# EAGLE design REP - Rev3 (EAGLE 9.6.2)
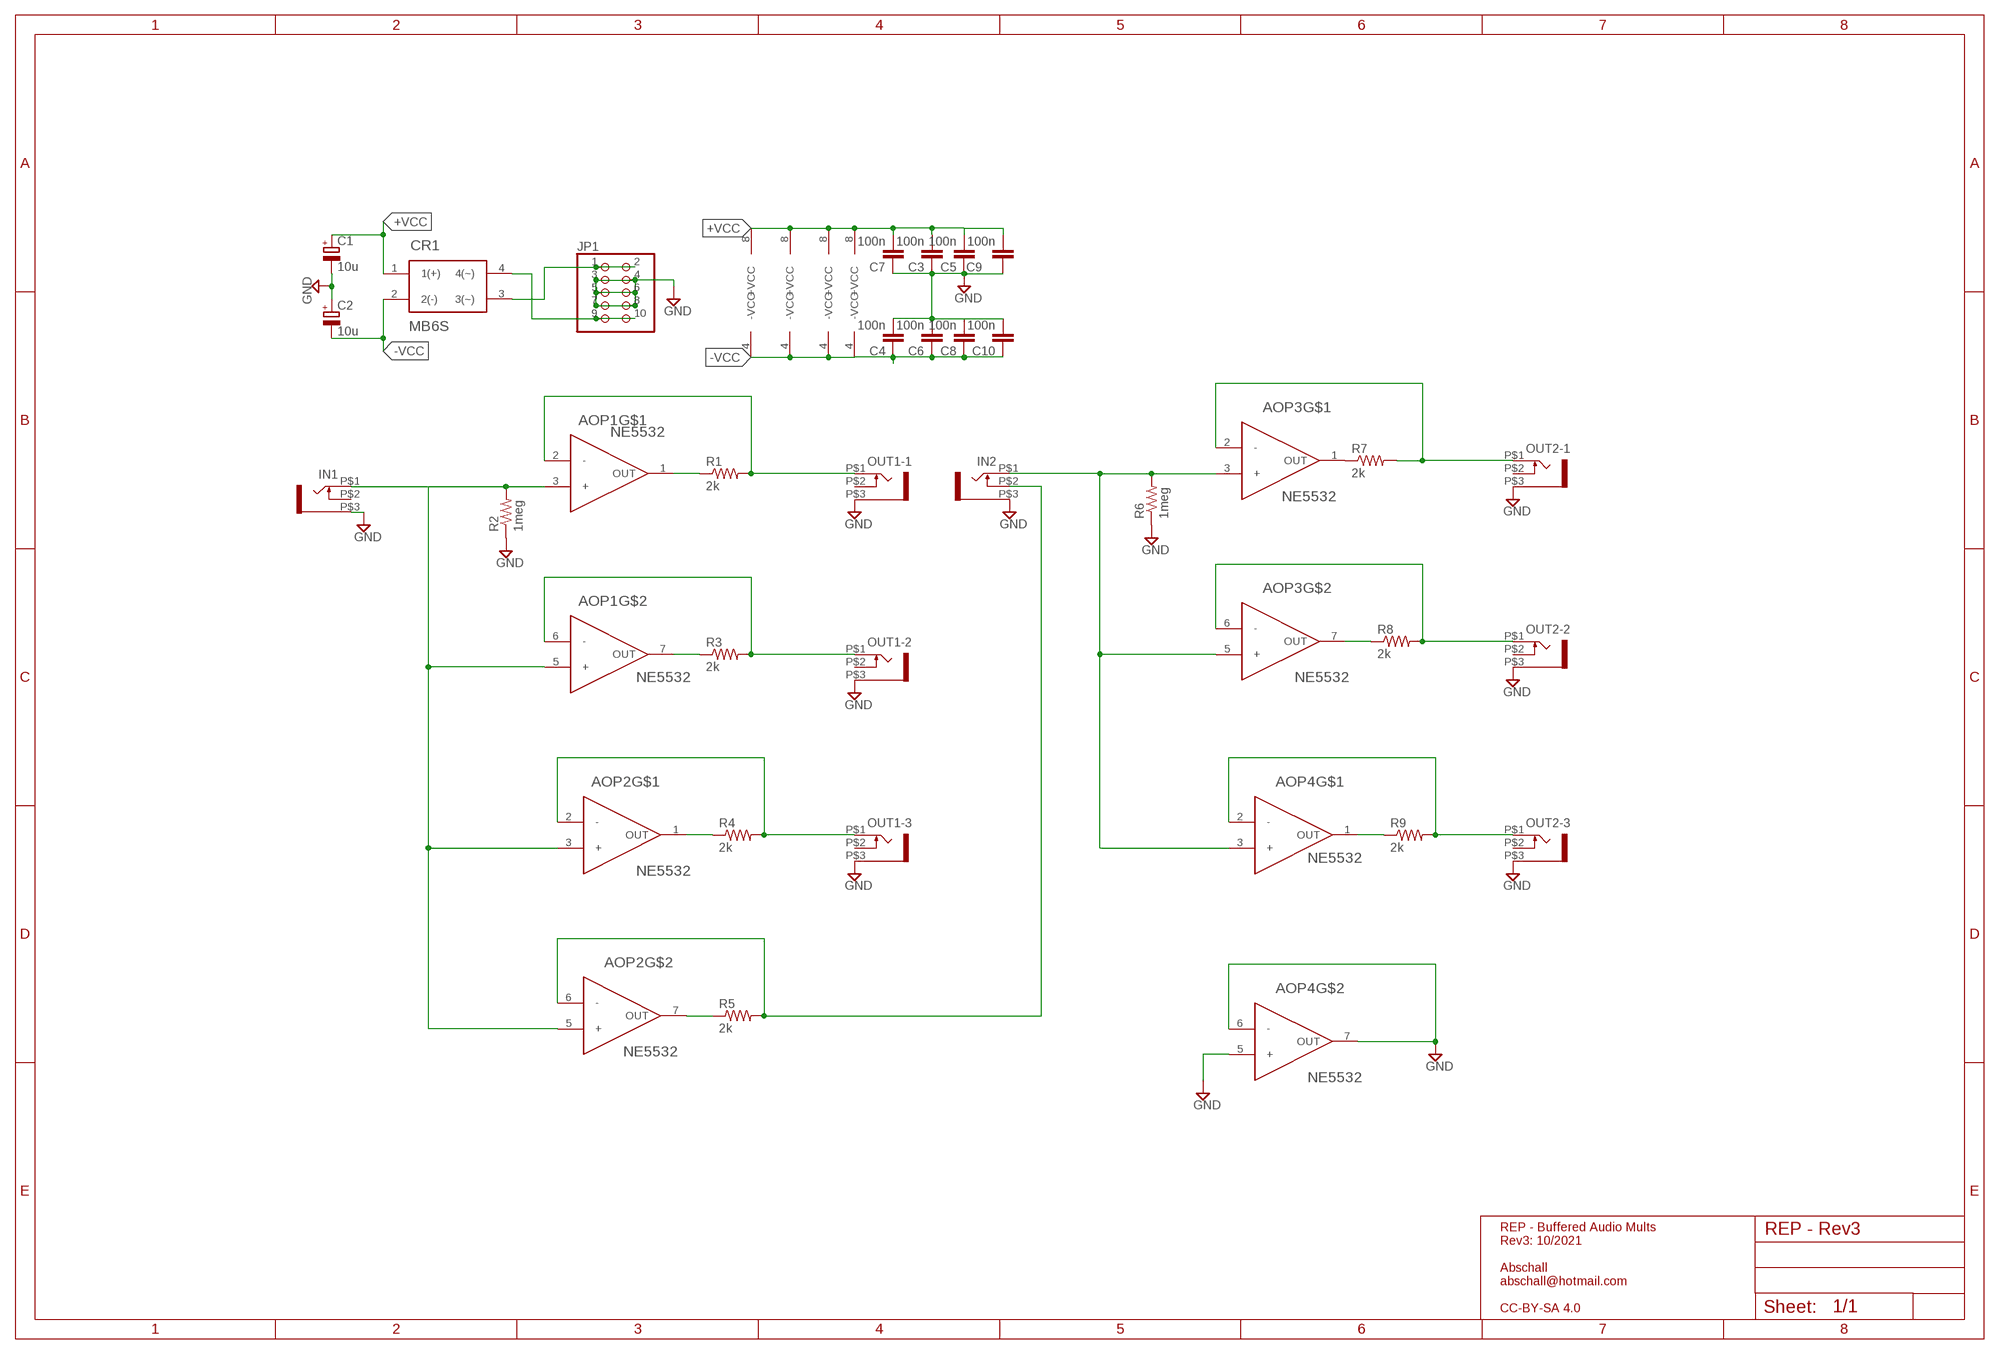
[diagram p0: schematic, sheet 1]

## Parts
AOP1  NE5532  TL072ACDR  [SOIC8]
AOP2  NE5532  TL072ACDR  [SOIC8]
AOP3  NE5532  TL072ACDR  [SOIC8]
AOP4  NE5532  TL072ACDR  [SOIC8]
C1  10u  CPOL-EUB  [PANASONIC_B]
C2  10u  CPOL-EUB  [PANASONIC_B]
C3  100n  C-EUC0805  [C0805]
C4  100n  C-EUC0805  [C0805]
C5  100n  C-EUC0805  [C0805]
C6  100n  C-EUC0805  [C0805]
C7  100n  C-EUC0805  [C0805]
C8  100n  C-EUC0805  [C0805]
C9  100n  C-EUC0805  [C0805]
C10  100n  C-EUC0805  [C0805]
CR1  MB6S  [4SOIC]
IN1  WQP-PJ301M-12_JACK  [WQP-PJ301M-12_JACK]
IN2  WQP-PJ301M-12_JACK  [WQP-PJ301M-12_JACK]
JP1  PINHD-2X5  [2X05]
OUT1-1  WQP-PJ301M-12_JACK  [WQP-PJ301M-12_JACK]
OUT1-2  WQP-PJ301M-12_JACK  [WQP-PJ301M-12_JACK]
OUT1-3  WQP-PJ301M-12_JACK  [WQP-PJ301M-12_JACK]
OUT2-1  WQP-PJ301M-12_JACK  [WQP-PJ301M-12_JACK]
OUT2-2  WQP-PJ301M-12_JACK  [WQP-PJ301M-12_JACK]
OUT2-3  WQP-PJ301M-12_JACK  [WQP-PJ301M-12_JACK]
R1  2k  R-US_R0805  [R0805]
R2  1meg  R-US_R0805  [R0805]
R3  2k  R-US_R0805  [R0805]
R4  2k  R-US_R0805  [R0805]
R5  2k  R-US_R0805  [R0805]
R6  1meg  R-US_R0805  [R0805]
R7  2k  R-US_R0805  [R0805]
R8  2k  R-US_R0805  [R0805]
R9  2k  R-US_R0805  [R0805]

## Nets
+VCC: AOP1.8(+VCC) AOP2.8(+VCC) AOP3.8(+VCC) AOP4.8(+VCC) C1.+ C3.2 C5.2 C7.2 C9.2 CR1.1(1(+))
-VCC: AOP1.4(-VCC) AOP2.4(-VCC) AOP3.4(-VCC) AOP4.4(-VCC) C2.- C4.1 C6.1 C8.1 C10.1 CR1.2(2(-))
GND: AOP4.5(+) AOP4.6(-) AOP4.7(OUT) C1.- C2.+ C3.1 C4.2 C5.1 C6.2 C7.1 C8.2 C9.1 IN1.P$3 IN2.P$3 JP1.3 JP1.4 JP1.5 JP1.6 JP1.7 JP1.8 OUT1-1.P$3 OUT1-2.P$3 OUT1-3.P$3 OUT2-1.P$3 OUT2-2.P$3 OUT2-3.P$3 R2.1 R6.1
N$1: AOP1.2(-) OUT1-1.P$1 R1.2
N$2: AOP1.6(-) OUT1-2.P$1 R3.2
N$3: AOP1.1(OUT) R1.1
N$4: AOP1.7(OUT) R3.1
N$5: CR1.3(3(~)) JP1.1 JP1.2
N$6: AOP1.3(+) AOP1.5(+) AOP2.3(+) AOP2.5(+) IN1.P$1 R2.2
N$7: AOP3.2(-) OUT2-1.P$1 R7.2
N$8: AOP2.1(OUT) R4.1
N$9: AOP3.6(-) OUT2-2.P$1 R8.2
N$10: AOP3.1(OUT) R7.1
N$11: AOP3.7(OUT) R8.1
N$12: AOP4.2(-) OUT2-3.P$1 R9.2
N$13: AOP4.1(OUT) R9.1
N$14: AOP3.3(+) AOP3.5(+) AOP4.3(+) IN2.P$1 R6.2
N$15: AOP2.7(OUT) R5.1
N$16: AOP2.2(-) OUT1-3.P$1 R4.2
N$18: C10.2
N$19: AOP2.6(-) IN2.P$2 R5.2
N$30: CR1.4(4(~)) JP1.9 JP1.10
Unconnected: IN1.P$2 OUT1-1.P$2 OUT1-2.P$2 OUT1-3.P$2 OUT2-1.P$2 OUT2-2.P$2 OUT2-3.P$2

## Notes on the sheet
- REP - Buffered Audio Mults 
  Rev3: 10/2021
  
  Abschall
  abschall@hotmail.com
  
  CC-BY-SA 4.0

## Library data of the parts
AOP1-AOP4 = personal-ICs:TL072ACDR
C1 C2 = rcl:CPOL-EU: POLARIZED CAPACITOR, European symbol; SPICEPREFIX: C
C3-C10 = resistor:C-EU: CAPACITOR, European symbol
CR1 = Bridge Rectifiers:MB6S: BRIDGE RECT 1P 600V 500MA 4SOIC Manufacturer's datasheet <https://www.onsemi.com/pub/Collateral/MB8S-D.PDF>; CREATED_BY: PCBLayout.com; DIGIKEY_PARTNO: MB6SCT-ND; MANUFACTURER: ON Semiconductor; MPN: MB6S; PACKAGE: 4-SOIC
IN1 IN2 OUT1-1-OUT1-3 OUT2-1-OUT2-3 = thonkiconn:WQP-PJ301M-12_JACK
JP1 = pinhead:PINHD-2X5: PIN HEADER
R1-R9 = resistor:R-US_: RESISTOR, American symbol

## Board
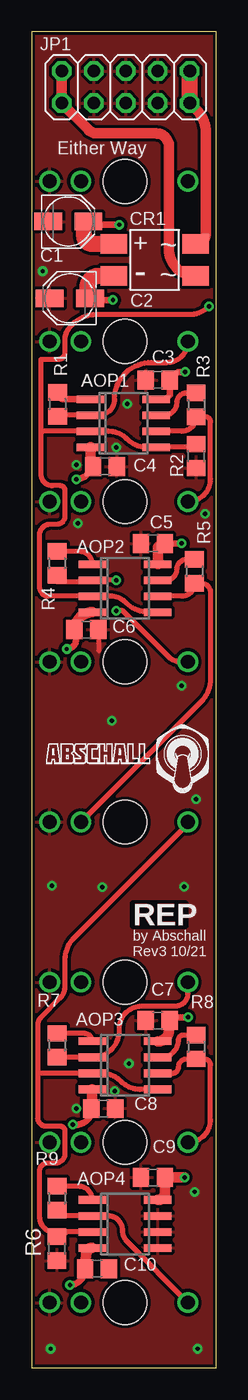
[diagram p1: board, top side]
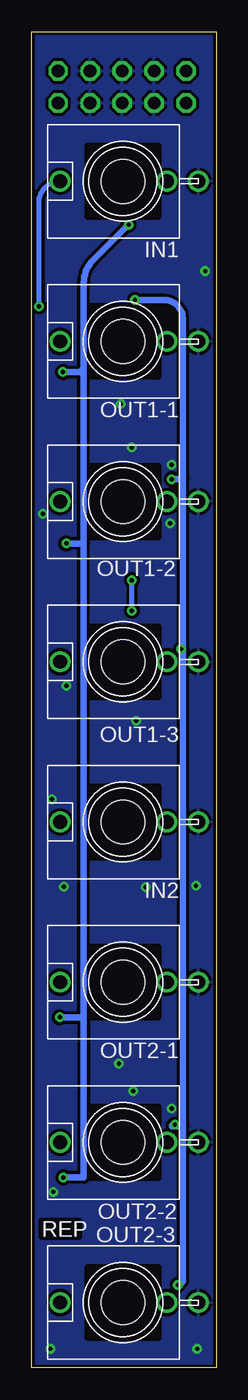
[diagram p2: board, bottom side, seen from below]

Size 14.7 x 106 mm. Coordinates in mm from the lower left corner, seen from the top.
Outline: 0,0 14.7,0 14.7,106 0,106 0,0
Copper layers (1*16): Top 0.035mm / dielectric 1.5mm / Bottom 0.035mm
Design rules "default *": minimum track width 6mil, minimum drill 0.35mm, track to track 6mil, track to pad 6mil, pad to pad 6mil, via to via 6mil, smd to smd 6mil, copper to edge 6mil, drill to drill 6mil, minimum pad ring 10mil, minimum via ring 8mil, stop-mask expansion 4mil, vias tented up to drill 0mil, thermal gap 10mil

### Footprints (pad centres in the part's own frame; a part is rotated, then mirrored left to right if it is on the bottom)
SOIC8 = smd 0.6 x 2.2: 1 -1.905,-2.6; 2 -0.635,-2.6; 3 0.635,-2.6; 4 1.905,-2.6; 5 1.905,2.6; 6 0.635,2.6; 7 -0.635,2.6; 8 -1.905,2.6
PANASONIC_B = smd 2.2 x 1.4: + 1.6,0; - -1.6,0
C0805 = smd 1.3 x 1.5: 1 -0.95,0; 2 0.95,0
4SOIC = smd 2.1 x 1.55: 1 -3.25,1.27; 2 -3.25,-1.27; 3 3.25,-1.27; 4 3.25,1.27
WQP-PJ301M-12_JACK = drill 1.1: P$1 0,5; P$2 0,-3.5; P$3 0,-5.992 | hole 3.5: 0,0
2X05 = drill 1.016 octagon: 1 -5.08,-1.27; 2 -5.08,1.27; 3 -2.54,-1.27; 4 -2.54,1.27; 5 0,-1.27; 6 0,1.27; 7 2.54,-1.27; 8 2.54,1.27; 9 5.08,-1.27; 10 5.08,1.27
R0805 = smd 1.3 x 1.5: 1 -0.95,0; 2 0.95,0

### Placement (x,y rotation side)
AOP1  7.3,74.93 270 top
AOP2  7.43,61.85 270 top
AOP3  7.43,24 270 top
AOP4  7.43,11.43 270 top
C1  2.92,90.93 0 top
C2  3.05,84.84 180 top
C3  10.03,78.36 0 top
C4  5.84,71.5 0 top
C5  9.65,65.41 0 top
C6  4.37,58.56 0 top
C7  10.03,27.56 0 top
C8  5.71,20.57 0 top
C9  9.65,15.11 0 top
C10  5.21,7.87 0 top
CR1  9.78,87.88 0 top
IN1  7.43,94.13 90 bottom
IN2  7.43,43.3 90 bottom
JP1  7.49,101.6 0 top
OUT1-1  7.43,81.42 90 bottom
OUT1-2  7.43,68.71 90 bottom
OUT1-3  7.43,56.01 90 bottom
OUT2-1  7.43,30.6 90 bottom
OUT2-2  7.43,17.89 90 bottom
OUT2-3  7.43,5.19 90 bottom
R1  2.06,76.44 270 top
R2  13.08,72.33 90 top
R3  13.08,76.39 270 top
R4  2.03,63.82 270 top
R5  12.95,63.18 270 top
R6  2.02,9.46 90 top
R7  2.03,25.59 270 top
R8  13.08,25.46 270 top
R9  2.03,13.46 270 top

### Tracks (layer width: path | path; a pad name or v marks a point on that pad's centre or on a via)
+VCC  (via drill 0.35)
  Top 0.406: AOP1.8 10.67,76.83 10.79,76.96
  Top 0.508: C5.2 arc45 10.54,65.44 arc45 10.62,65.41 v11.94,65.41 | v12.45,27.81 11.24,27.81 C7.2 | v6.99,90.68 4.78,90.68 arc-90 C1.+ | 10.79,76.96 10.98,77.15 C3.2 11.62,78.99 v12.19,78.99
  Top 0.813: C5.2 arc90 10.03,64.91 AOP2.8 | AOP3.8 arc90 10.93,26.81 C7.2 | AOP4.8 arc90 10.6,13.91 C9.2 v12.16,15.11
  Top 1.27: CR1.1 4.83,89.15 arc-90 4.19,89.79 4.19,90.6 arc-90 C1.+
  Bottom 0.508: 10.54,27.81 10.54,65.41 | 10.54,65.41 10.54,79.25 | 10.54,79.25 10.54,86.07 arc45 9.8,87.87 v6.99,90.68 | 10.54,65.41 v11.94,65.41 | v12.45,27.81 10.54,27.81 | 10.54,27.81 10.54,15.11 v12.16,15.11 | v12.19,78.99 10.79,78.99 10.54,79.25
-VCC  (via drill 0.35)
  Top 0.508: v6.48,84.71 4.78,84.71 arc-90 C2.- | C10.1 arc-90 v3.07,6.59 | v3.3,19.3 arc90 4.86,20.44 C8.1 | v2.79,57.02 arc90 3.54,57.77 C6.1 | v3.56,70.48 arc90 4.7,71.63 C4.1
  Top 0.813: C4.1 4.7,71.51 AOP1.4 | AOP2.4 arc90 3.45,58.56 C6.1 | AOP4.4 arc90 4.36,9.05 C10.1 | AOP3.4 4.83,21.89 C8.1
  Top 1.27: CR1.2 5.33,86.61 arc90 4.45,85.72 4.45,85.04 arc90 C2.-
  Bottom 0.5: v3.07,6.59 arc-90 2.67,7 2.67,19.18 2.67,57.02 2.67,70.61 2.67,83.19 arc-90 4.19,84.71
  Bottom 0.508: 4.19,84.71 v6.48,84.71 | 2.67,19.18 3.56,19.18 arc90 v3.3,19.3 | 2.67,57.02 v2.79,57.02 | 2.67,70.61 arc90 2.79,70.48 v3.56,70.48
GND  (via drill 0.35)
  Top 0.406: C6.2 5.33,58.54 5.33,56.9
  other vias: 6.37,51.35 12.14,38.18 7.75,24.13 1.52,1.52 13.21,1.52 12.95,13.97 3.68,67 13.06,45.11 11.94,54.1 3.56,71.63 13.8,67.74 1.64,38.24 0.89,87 3.56,20.57 6.6,21.97 7.62,76.45 6.73,73.03 5.63,38.14
  pour Bottom (isolate 0.254): -0.38,106.43 -0.38,-0.51 15.24,-0.51 15.24,106.43
  pour Top (isolate 0.254): -0.25,106.05 -0.25,-0.25 15.24,-0.25 15.24,106.05
N$1
  Top 0.406: R1.2 arc-90 2.14,75.56 AOP1.2 5.33,75.56 arc90 6.6,76.83 arc-90 9.53,79.76 10.77,79.76 arc90 OUT1-1.P$1
N$2
  Top 0.406: AOP1.6 11.94,74.3 arc90 R3.2 arc90 R3.2 13.84,75.44 arc-90 14.22,75.06 14.22,70.51 arc-90 OUT1-2.P$1
N$3
  Top 0.508: AOP1.1 2.62,76.83 arc-90 R1.1
N$4
  Top 0.406: AOP1.7 10.54,75.56 arc90 11.56,76.58 arc-90 12.32,77.34 R3.1
N$5
  Top 0.813: JP1.2 JP1.1 4.53,98.21 arc45 5.24,97.92 9.91,97.92 arc-90 10.92,96.9 10.92,88.72 arc90 CR1.3
N$6  (via drill 0.35)
  Top 0.39: 2.67,67.56 2.67,69.6
  Top 0.406: R2.2 arc-90 12.83,73.03 AOP1.5 9.15,73.03 arc-45 7.62,73.66 7.6,73.68 arc45 6.11,74.3 AOP1.3 0.9,74.3 0.8,74.34 arc-45 0.76,74.35 | AOP2.5 9.31,59.94 arc-45 7.51,60.69 7.49,60.71 arc45 6.27,61.21 AOP2.3 1.31,61.21 arc-45 0.9,61.38 arc-45 0.64,62.02 0.64,66.04 arc-90 1.52,66.93 2.03,66.93 arc90 2.67,67.56 | 2.67,69.6 arc90 2.29,69.98 1.65,69.98 arc-90 0.76,70.87 0.76,74.35 | 0.76,74.35 0.76,80.01 2.16,80.01 arc90 2.67,80.52 2.67,81.53 arc-45 3.12,82.62 3.32,82.82 arc-45 5.12,83.57 12.56,83.57 arc45 v14.1,84.2
  Bottom 0.406: IN1.P$1 arc-90 14.1,92.46 v14.1,84.2
N$7
  Top 0.406: R7.2 AOP3.2 arc-90 AOP3.2 arc90 6.99,26.79 6.99,26.92 arc-90 8.76,28.7 11.43,28.7 arc90 12.43,29.7 OUT2-1.P$1
N$8
  Top 0.406: AOP2.1 arc90 3.82,64.77 R4.1
N$9
  Top 0.406: AOP3.6 11.18,23.37 arc90 11.68,23.88 arc-90 12.32,24.51 R8.2 arc90 R8.2 13.72,24.51 arc-90 14.22,24 14.22,19.69 arc-90 OUT2-2.P$1
N$10
  Top 0.406: AOP3.1 arc90 4.2,26.54 R7.1
N$11
  Top 0.406: AOP3.7 10.29,24.64 arc90 11.68,26.04 arc-90 12.06,26.41 R8.1
N$12
  Top 0.406: R9.2 arc90 2.48,12.06 AOP4.2 6.1,12.06 arc-90 7.24,10.92 arc45 7.62,10 OUT2-3.P$1
N$13
  Top 0.406: AOP4.1 arc90 3.75,14.41 R9.1
N$14
  Top 0.406: AOP4.3 2.81,10.79 | AOP3.5 8.62,22.1 arc-45 7.13,22.71 7.11,22.73 arc45 5.58,23.37 AOP3.3 0.6,23.37 arc90 0.51,23.27 | IN2.P$1 12.43,43.16 3.41,34.15 arc45 2.67,32.35 2.67,30.26 arc-45 2.29,29.34 0.72,27.78 arc45 0.51,27.25 0.51,23.27 | 0.51,23.27 0.51,19.81 arc90 1.14,19.18 2.29,19.18 arc-90 2.67,18.8 2.67,17.02 arc-90 1.91,16.26 1.27,16.26 arc90 0.64,15.62 0.64,11.96 arc90 1.8,10.79 2.81,10.79 | 2.81,10.79 2.71,10.7 arc-45 R6.2
N$15
  Top 0.406: AOP2.7 10.67,62.48 arc90 11.56,63.37 arc-90 12.32,64.13 R5.1
N$16  (via drill 0.35)
  Top 0.406: R4.2 2.03,62.36 4.7,62.36 AOP2.2 v6.73,62.48 | OUT1-3.P$1 11.85,56.01 arc-45 10.92,56.39 7.24,60.07 v6.73,60.07
  Bottom 0.406: v6.73,60.07 v6.73,62.48
N$19
  Top 0.406: AOP2.6 11.94,61.21 arc90 R5.2 13.48,62.23 arc-90 14.24,61.48 14.24,54.67 arc-45 13.5,52.87 IN2.P$2
N$30
  Top 0.813: CR1.4 arc90 13.84,89.97 13.84,98.01 arc45 13.1,99.8 JP1.9
  Top 1.27: JP1.9 JP1.10

### Text on the board
Top: REP
Bottom: REP
tPlace: Either Way | REP | by Abschall / Rev3 10/21
bPlace: REP